# Altium project WateringMachine.PrjPcb
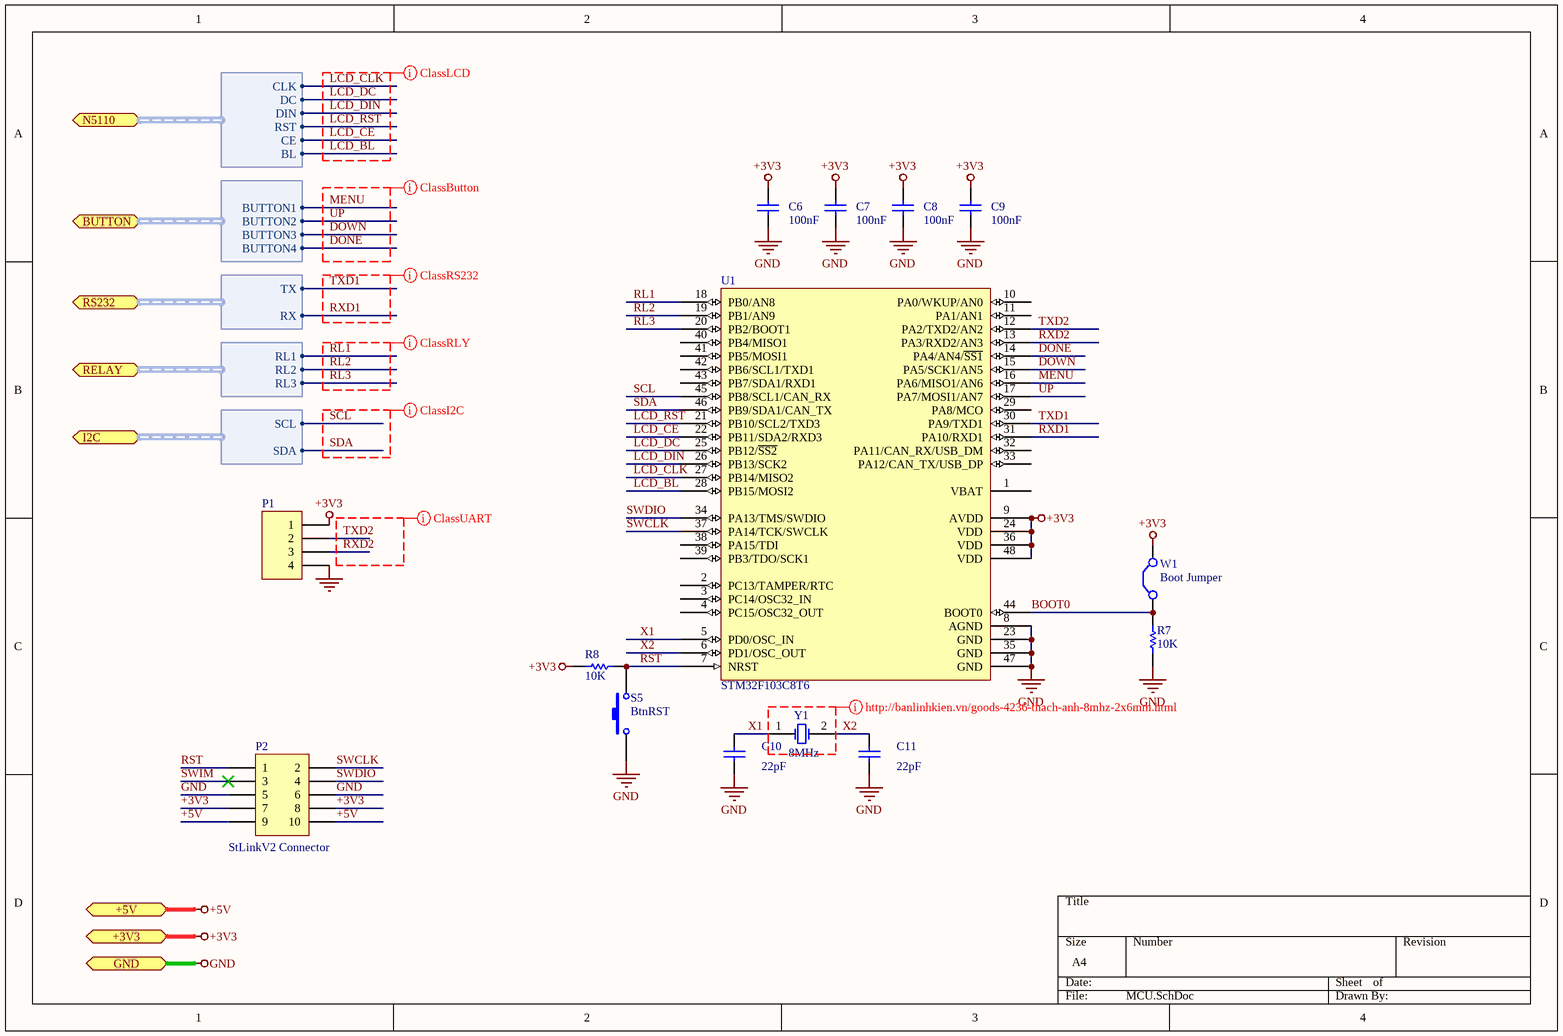
[diagram p0: MCU.SchDoc]
3 sheets, 43 parts. Net scope: flat (ports and power ports of the same name join across sheets).
Board file: WateringMachine.PcbDoc
Sheets:
  MCU.SchDoc
  RelayController.SchDoc
  Display.SchDoc

## Sheet MCU.SchDoc
size A4

### Parts
C6  value 100nF  [C-0805]  (hidden comment: 104)
C7  value 100nF  [C-0805]  (hidden comment: 104)
C8  value 100nF  [C-0805]  (hidden comment: 104)
C9  value 100nF  [C-0805]  (hidden comment: 104)
C10  value 22pF  [C-0805]  (hidden comment: 22)
C11  value 22pF  [C-0805]  (hidden comment: 22)
P1  XH2.54-4P  [CONN-XH2.54-4P]  (value not drawn)
P2  value StLinkV2 Connector  [CONN-IDC-5X2-A]  (hidden comment: IDC5x2A)
R7  10K  [R-0805]
R8  10K  [R-0805]
S5  value BtnRST  [SW-T-S6]  (hidden comment: SW-T-S6)
U1  STM32F103C8T6  [LQFP-48]
W1  value Boot Jumper  [JP2.54-M-1x02A]  (hidden comment: JP2.54-M)
Y1  value 8MHz  [R38]  (hidden comment: 49S-8MHz)

### Ports
+3V3, +5V, BUTTON (harness BUTTON), GND, I2C (harness I2C), N5110 (harness N5110LCD), RELAY (harness RELAY), RS232 (harness RS232)

### Harnesses
N5110LCD: CLK, DC, DIN, RST, CE, BL
BUTTON: BUTTON1, BUTTON2, BUTTON3, BUTTON4
RS232: TX, RX
RELAY: RL1, RL2, RL3
I2C: SCL, SDA

### Nets
+3V3: C6.1 C7.1 C8.1 C9.1 P1.1 P2.7 P2.8 R8.2 U1.9(AVDD) U1.24(VDD) U1.36(VDD) U1.48(VDD) W1.2(C2) ; port +3V3
+5V: P2.9 P2.10 ; port +5V
GND: C6.2 C7.2 C8.2 C9.2 C10.2 C11.2 P1.4 P2.5 P2.6 R7.2 S5.1 U1.8(AGND) U1.23(GND) U1.35(GND) U1.47(GND) ; port GND
BOOT0: R7.1 U1.44(BOOT0) W1.1(C1)
DONE: U1.14(PA4/AN4/~{SS1}) ; port BUTTON.BUTTON4
DOWN: U1.15(PA5/SCK1/AN5) ; port BUTTON.BUTTON3
LCD_BL: U1.28(PB15/MOSI2) ; port N5110.BL
LCD_CE: U1.22(PB11/SDA2/RXD3) ; port N5110.CE
LCD_CLK: U1.27(PB14/MISO2) ; port N5110.CLK
LCD_DC: U1.25(PB12/~{SS2}) ; port N5110.DC
LCD_DIN: U1.26(PB13/SCK2) ; port N5110.DIN
LCD_RST: U1.21(PB10/SCL2/TXD3) ; port N5110.RST
MENU: U1.16(PA6/MISO1/AN6) ; port BUTTON.BUTTON1
RL1: U1.18(PB0/AN8) ; port RELAY.RL1
RL2: U1.19(PB1/AN9) ; port RELAY.RL2
RL3: U1.20(PB2/BOOT1) ; port RELAY.RL3
RST: P2.1 R8.1 S5.2 U1.7(NRST)
RXD1: U1.31(PA10/RXD1) ; port RS232.RX
RXD2: P1.3 U1.13(PA3/RXD2/AN3)
SCL: U1.45(PB8/SCL1/CAN_RX) ; port I2C.SCL
SDA: U1.46(PB9/SDA1/CAN_TX) ; port I2C.SDA
SWCLK: P2.2 U1.37(PA14/TCK/SWCLK)
SWDIO: P2.4 U1.34(PA13/TMS/SWDIO)
SWIM: P2.3
TXD1: U1.30(PA9/TXD1) ; port RS232.TX
TXD2: P1.2 U1.12(PA2/TXD2/AN2)
UP: U1.17(PA7/MOSI1/AN7) ; port BUTTON.BUTTON2
X1: C10.1 U1.5(PD0/OSC_IN) Y1.1(OSC1)
X2: C11.1 U1.6(PD1/OSC_OUT) Y1.2(OSC2)

Not connected (* = marked no-connect by the designer): U1 1(VBAT) 2(PC13/TAMPER/RTC) 3(PC14/OSC32_IN) 4(PC15/OSC32_OUT) 10(PA0/WKUP/AN0) 11(PA1/AN1) 29(PA8/MCO) 32(PA11/CAN_RX/USB_DM) 33(PA12/CAN_TX/USB_DP) 38(PA15/TDI) 39(PB3/TDO/SCK1) 40(PB4/MISO1) 41(PB5/MOSI1) 42(PB6/SCL1/TXD1) 43(PB7/SDA1/RXD1)

### Layout directives
net class LCD: LCD_BL, LCD_CE, LCD_CLK, LCD_DC, LCD_DIN, LCD_RST
net class BUTTON: DONE, DOWN, MENU, UP
net class RS232: RXD1, TXD1
net class RLY_CTRL: RL1, RL2, RL3
net class I2C: SCL, SDA
net class UART: (no net found under the mark), RXD2, TXD2

### Library data of the parts
C6-C11 = Cap: Capacitor; Published: 8-Jun-2000; LatestRevisionDate: 17-Jul-2002; LatestRevisionNote: Re-released for DXP Platform.; PackageReference: RAD-0.3; Publisher: Altium Limited
P1 = Header 4: Header, 4-Pin; Value: USART Connector; LatestRevisionDate: 17-Jul-2002; LatestRevisionNote: Re-released for DXP Platform.
P2 = Header 5X2: Header, 5-Pin, Dual row; LatestRevisionDate: 17-Jul-2002; LatestRevisionNote: Re-released for DXP Platform.
R7 R8 = Res1: Resistor; Published: 8-Jun-2000; LatestRevisionDate: 17-Jul-2002; LatestRevisionNote: Re-released for DXP Platform.; PackageReference: AXIAL-0.3; Publisher: Altium Limited; PackageDescription: Axial Device, Thru-Hole; 2 Leads; 0.3 in Pin Spacing; Value: 10K
S5 = SW-PB: Switch; Published: 24-Mar-1999; LatestRevisionDate: 17-Jul-2002; LatestRevisionNote: Re-released for DXP Platform.; PackageReference: SPST-2; PackageDescription: Switch; 2 Leads
U1 = STM32F103C8T6: 32bits STM32 48 Pins; Value: STM32F103C8T6
W1 = Jumper: Jumper Wire; Published: 24-Mar-1999; LatestRevisionDate: 17-Jul-2002; LatestRevisionNote: Re-released for DXP Platform.; PackageReference: RAD-0.2; PackageDescription: Radial Cap, Thru-Hole; 2 Leads; 0.2 in Pin Spacing
Y1 = XTAL: Crystal Oscillator; Published: 8-Jun-2000; LatestRevisionDate: 17-Jul-2002; LatestRevisionNote: Re-released for DXP Platform.; PackageReference: R38; PackageDescription: Crystal, Thru-Hole; 2 Leads; Body 3.1 x 8.2 mm (Dia.xH)

## Sheet RelayController.SchDoc
size A4
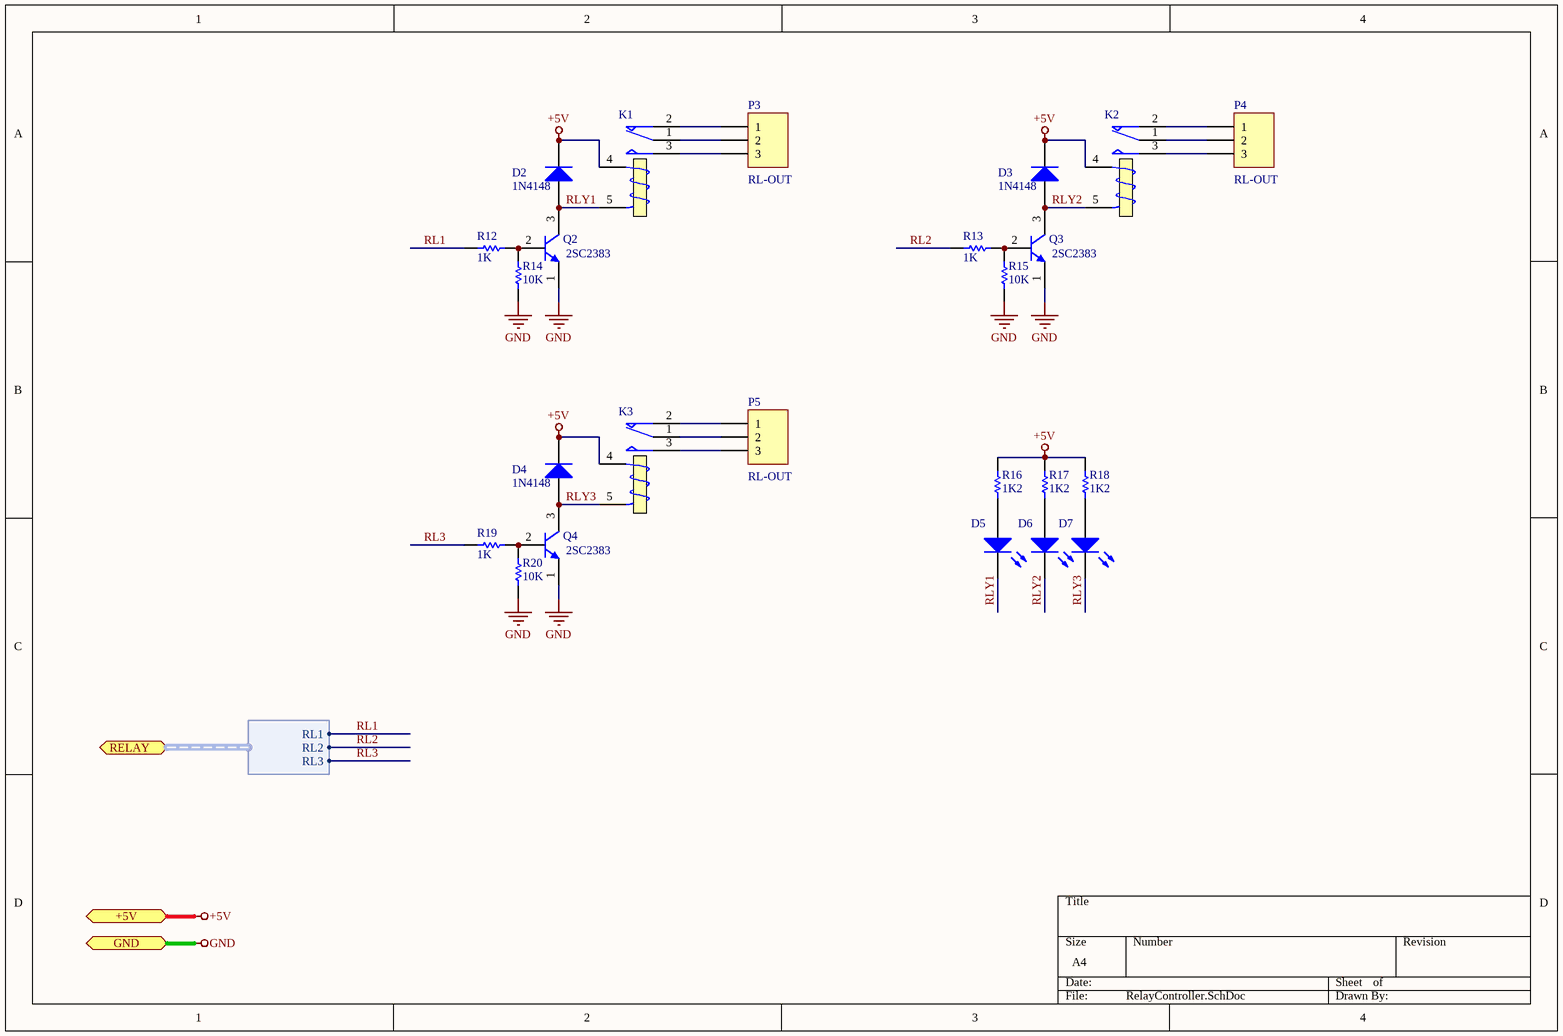
[diagram p1: RelayController.SchDoc]

### Parts
D2  1N4148  [D-DO213-AA]
D3  1N4148  [D-DO213-AA]
D4  1N4148  [D-DO213-AA]
D5  SMD0805-RED  [LED-0805]  (value not drawn)
D6  SMD0805-RED  [LED-0805]  (value not drawn)
D7  SMD0805-RED  [LED-0805]  (value not drawn)
K1  RL-5P-10A  [RL-5P-10A]  (value not drawn)
K2  RL-5P-10A  [RL-5P-10A]  (value not drawn)
K3  RL-5P-10A  [RL-5P-10A]  (value not drawn)
P3  value RL-OUT  [TER-KF128-3P]  (hidden comment: KF128-3P)
P4  value RL-OUT  [TER-KF128-3P]  (hidden comment: KF128-3P)
P5  value RL-OUT  [TER-KF128-3P]  (hidden comment: KF128-3P)
Q2  value 2SC2383  [TO-92AB]  (hidden comment: C2383)
Q3  value 2SC2383  [TO-92AB]  (hidden comment: C2383)
Q4  value 2SC2383  [TO-92AB]  (hidden comment: C2383)
R12  1K  [R-0805]
R13  1K  [R-0805]
R14  10K  [R-0805]
R15  10K  [R-0805]
R16  1K2  [R-0805]
R17  1K2  [R-0805]
R18  1K2  [R-0805]
R19  1K  [R-0805]
R20  10K  [R-0805]

### Ports
+5V, GND, RELAY (harness RELAY)

### Harnesses
RELAY: RL1, RL2, RL3

### Nets
+5V: D2.2(K) D3.2(K) D4.2(K) K1.4(T1) K2.4(T1) K3.4(T1) R16.2 R17.2 R18.2 ; port +5V
GND: Q2.1(E) Q3.1(E) Q4.1(E) R14.2 R15.2 R20.2 ; port GND
RL1: R12.2 ; port RELAY.RL1
RL2: R13.2 ; port RELAY.RL2
RL3: R19.2 ; port RELAY.RL3
RLY1: D2.1(A) D5.2(K) K1.5(T2) Q2.3(C)
RLY2: D3.1(A) D6.2(K) K2.5(T2) Q3.3(C)
RLY3: D4.1(A) D7.2(K) K3.5(T2) Q4.3(C)
NetD5_1: D5.1(A) R16.1
NetD6_1: D6.1(A) R17.1
NetD7_1: D7.1(A) R18.1
NetK1_1: K1.1(COM) P3.2
NetK1_2: K1.2(NC) P3.1
NetK1_3: K1.3(NO) P3.3
NetK2_1: K2.1(COM) P4.2
NetK2_2: K2.2(NC) P4.1
NetK2_3: K2.3(NO) P4.3
NetK3_1: K3.1(COM) P5.2
NetK3_2: K3.2(NC) P5.1
NetK3_3: K3.3(NO) P5.3
NetQ2_2: Q2.2(B) R12.1 R14.1
NetQ3_2: Q3.2(B) R13.1 R15.1
NetQ4_2: Q4.2(B) R19.1 R20.1

### Library data of the parts
D2-D4 = Diode 1N4148: High Conductance Fast Diode; Published: 8-Jun-2000; LatestRevisionDate: 17-Jul-2002; LatestRevisionNote: Re-released for DXP Platform.; DatasheetVersion: 1997; PackageReference: DO-35; Value: 1N4148; PackageDescription: Diode, Axial; Body 3.8 x 1.9 mm (LxDia. max), Lead Dia. 0.53 mm (max); Code_JEDEC: DO-204-AH; ComponentLink1Description: Manufacturer Link; ComponentLink1URL: http://www.fairchildsemi.com/; ComponentLink2Description: Datasheet; ComponentLink2URL: http://www.fairchildsemi.com/ds/1N%2F1N4148.pdf
D5-D7 = LED0: Typical INFRARED GaAs LED; Value: StatusLed; Published: 8-Jun-2000; LatestRevisionDate: 08-Jul-2005; LatestRevisionNote: Mech Layer 1 removed.; PackageReference: LED-0
K1-K3 = Relay: SPDT Relay; Value: 5V/10A; Published: 8-Jun-2000; LatestRevisionDate: 17-Jul-2002; LatestRevisionNote: Re-released for DXP Platform.; PackageReference: MODULE5B
P3-P5 = Header 3: Header, 3-Pin; LatestRevisionDate: 17-Jul-2002; LatestRevisionNote: Re-released for DXP Platform.
Q2-Q4 = NPN: NPN Bipolar Transistor; Published: 8-Jun-2000; LatestRevisionDate: 17-Jul-2002; LatestRevisionNote: Re-released for DXP Platform.; PackageReference: TO-226-AA; PackageDescription: TO, Flat Index; 3 In-Line, Axial Leads; Body Dia. 4.8mm; Leads 0.55 x 0.51 mm (max); Code_JEDEC: TO-226-AA
R12-R20 = Res1: Resistor; Published: 8-Jun-2000; LatestRevisionDate: 17-Jul-2002; LatestRevisionNote: Re-released for DXP Platform.; PackageReference: AXIAL-0.3; Publisher: Altium Limited; PackageDescription: Axial Device, Thru-Hole; 2 Leads; 0.3 in Pin Spacing
  R12 R13 R19: Value: 1K
  R14 R15 R20: Value: 10K
  R16-R18: Value: 1K2

## Sheet Display.SchDoc
size A4
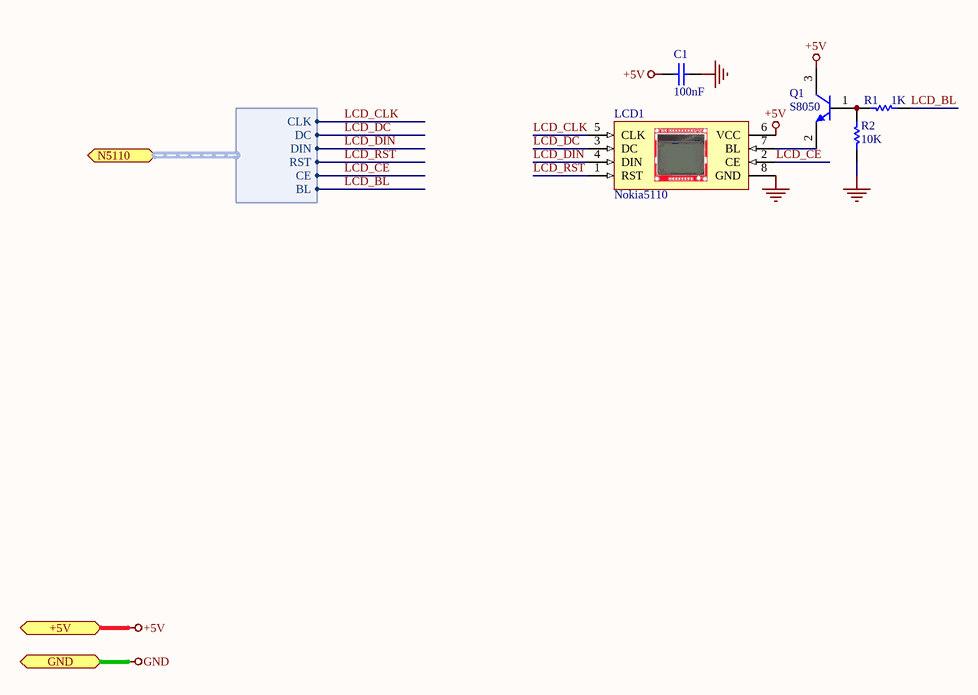
[diagram p2: Display.SchDoc]

### Parts
C1  value 100nF  [C-0805]  (hidden comment: 104)
LCD1  value Nokia5110  [LCD-N5110]  (hidden comment: LCD-N5110)
Q1  S8050  [SOT-23-3]
R1  1K  [R-0805]
R2  10K  [R-0805]

### Ports
+5V, GND, N5110 (harness N5110LCD)

### Harnesses
N5110LCD: CLK, DC, DIN, RST, CE, BL

### Nets
+5V: C1.1 LCD1.6(VCC) Q1.3(C) ; port +5V
GND: C1.2 LCD1.8(GND) R2.1 ; port GND
LCD_BL: R1.2 ; port N5110.BL
LCD_CE: LCD1.2(CE) ; port N5110.CE
LCD_CLK: LCD1.5(CLK) ; port N5110.CLK
LCD_DC: LCD1.3(DC) ; port N5110.DC
LCD_DIN: LCD1.4(DIN) ; port N5110.DIN
LCD_RST: LCD1.1(RST) ; port N5110.RST
NetLCD1_7: LCD1.7(BL) Q1.2(E)
NetQ1_1: Q1.1(B) R1.1 R2.2

### Library data of the parts
C1 = Cap: Capacitor; Published: 8-Jun-2000; LatestRevisionDate: 17-Jul-2002; LatestRevisionNote: Re-released for DXP Platform.; PackageReference: RAD-0.3; Publisher: Altium Limited; PackageDescription: Radial Cap, Thru-Hole; 2 Leads; 0.3 in Pin Spacing
Q1 = NPN: NPN Bipolar Transistor; Published: 8-Jun-2000; LatestRevisionDate: 17-Jul-2002; LatestRevisionNote: Re-released for DXP Platform.; PackageReference: TO-226-AA; Value: S8050; PackageDescription: TO, Flat Index; 3 In-Line, Axial Leads; Body Dia. 4.8mm; Leads 0.55 x 0.51 mm (max); Code_JEDEC: TO-226-AA
R1 R2 = Res1: Resistor; Published: 8-Jun-2000; LatestRevisionDate: 17-Jul-2002; LatestRevisionNote: Re-released for DXP Platform.; PackageReference: AXIAL-0.3; Publisher: Altium Limited; PackageDescription: Axial Device, Thru-Hole; 2 Leads; 0.3 in Pin Spacing
  R1: Value: 1K
  R2: Value: 10K

## Nets that join several sheets
+5V: MCU (P2.9 P2.10), RelayController (9 pins), Display (C1.1 LCD1.6 Q1.3)
GND: MCU (15 pins), RelayController (6 pins), Display (C1.2 LCD1.8 R2.1)
LCD_BL: MCU (U1.28), Display (R1.2)
LCD_CE: MCU (U1.22), Display (LCD1.2)
LCD_CLK: MCU (U1.27), Display (LCD1.5)
LCD_DC: MCU (U1.25), Display (LCD1.3)
LCD_DIN: MCU (U1.26), Display (LCD1.4)
LCD_RST: MCU (U1.21), Display (LCD1.1)
RL1: MCU (U1.18), RelayController (R12.2)
RL2: MCU (U1.19), RelayController (R13.2)
RL3: MCU (U1.20), RelayController (R19.2)